# Altium schematic sheet [XX] - DOC REVISION HISTORY.SchDoc
size A3; DocumentNumber: 4; SheetNumber: 4; SheetTotal: 5
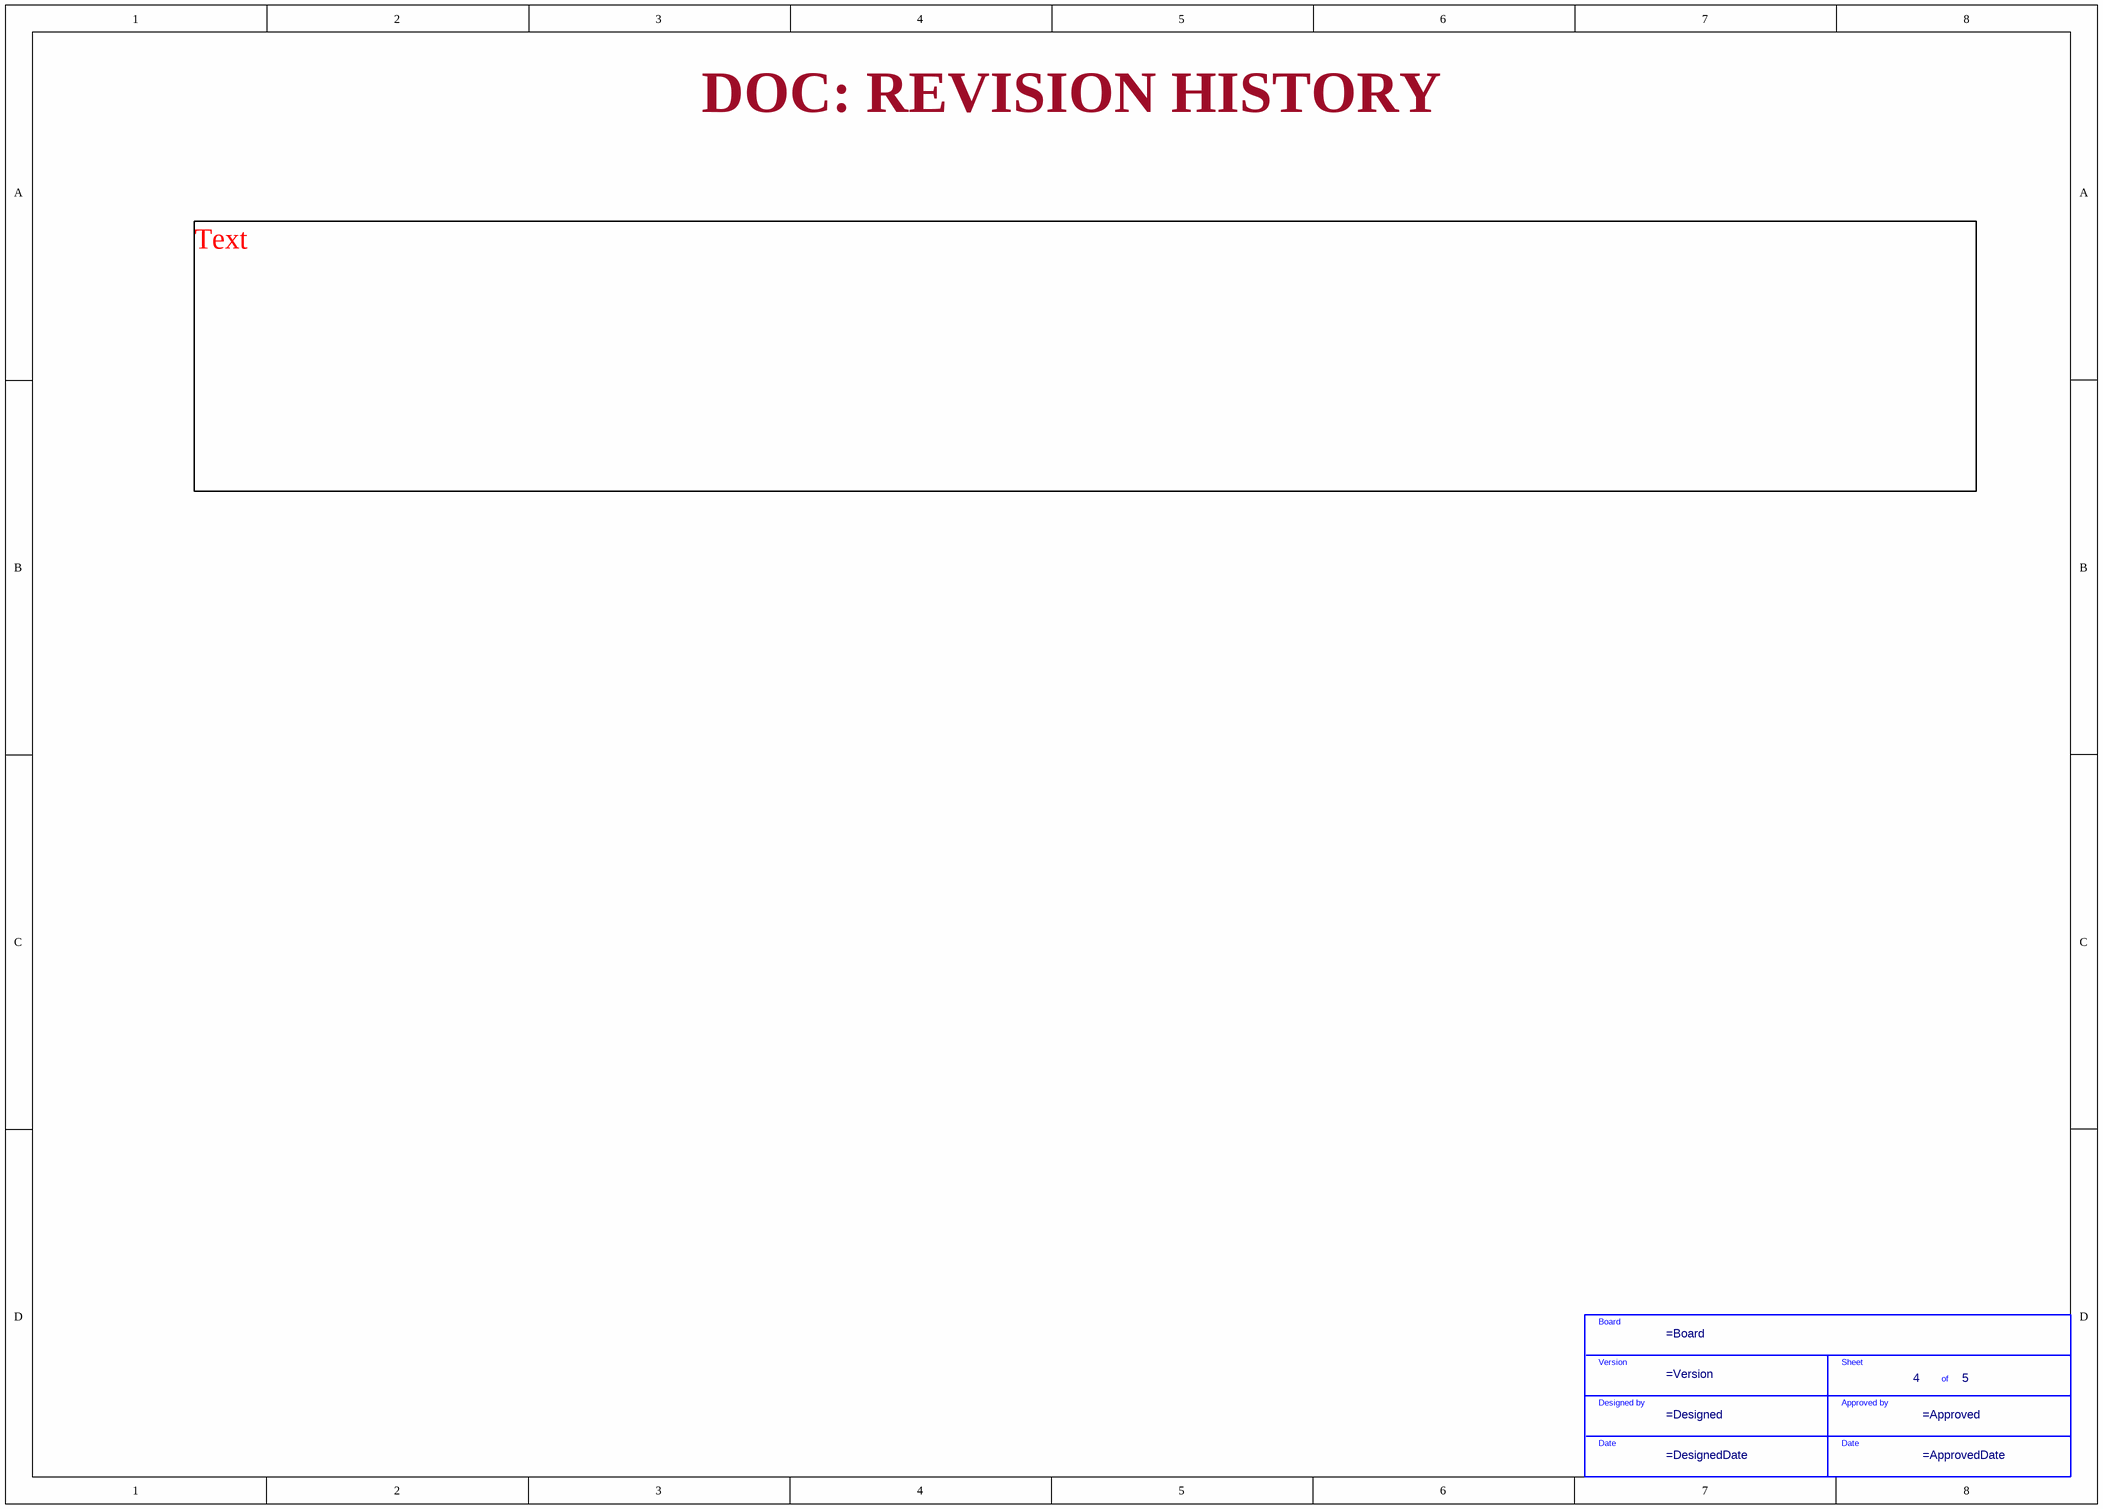
[diagram p0: [XX] - DOC REVISION HISTORY.SchDoc]

## Parts
STB  -  (value not drawn)  (graphical)

## Notes on the sheet
- DOC: REVISION HISTORY
- Text
- CLOCKS (CPU & PCIE)
- (in symbol Schematic Title Block) Board; Version; Sheet; of; Designed by; Approved by; Date

## Library data of the parts
STB = Schematic Title Block